# Altium schematic sheet HV_supply.SchDoc: High-voltage power supply
size A4; Author: L. Sartory; Organization: L. Sartory; Address2: Nixie clock; Address3: with GPS synchronization; DocumentNumber: 10; Revision: B1; SheetNumber: 10; SheetTotal: 12
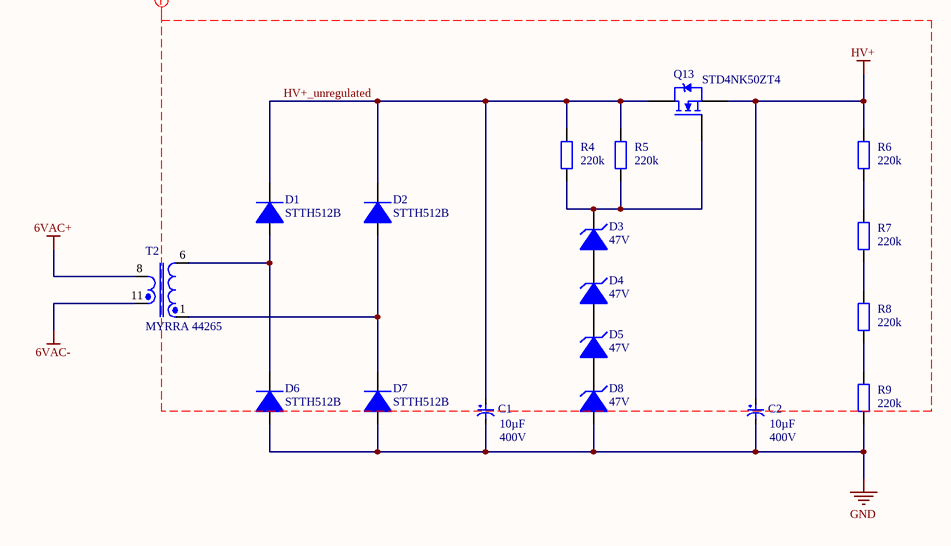
[diagram p0: HV_supply.SchDoc]

## Parts
C1  value 10µF  Voltage: 400V  [EEVEB2G100SM]  (hidden comment: EEVEB2G100SM)
C2  value 10µF  Voltage: 400V  [EEVEB2G100SM]  (hidden comment: EEVEB2G100SM)
D1  STTH512B  [STTH512B]
D2  STTH512B  [STTH512B]
D3  47V  [1SMB5941BT3G]
D4  47V  [1SMB5941BT3G]
D5  47V  [1SMB5941BT3G]
D6  STTH512B  [STTH512B]
D7  STTH512B  [STTH512B]
D8  47V  [1SMB5941BT3G]
Q13  STD4NK50ZT4  [STD4NK50ZT4]
R4  220k  [RES0805]
R5  220k  [RES0805]
R6  220k  [RES0805]
R7  220k  [RES0805]
R8  220k  [RES0805]
R9  220k  [RES0805]
T2  MYRRA 44265  [MYRRA_44265]

## Nets
6VAC+: T2.8
6VAC-: T2.11
GND: C1.2 C2.2 D6.A D7.A D8.A R9.1
HV+: C2.1 Q13.s(S) R6.2
HV+_unregulated: C1.1 D1.K D2.K Q13.D R4.2 R5.2
NetD1_A: D1.A D6.K T2.6
NetD2_A: D2.A D7.K T2.1
NetD3_A: D3.A D4.K
NetD3_K: D3.K Q13.G R4.1 R5.1
NetD4_A: D4.A D5.K
NetD5_A: D5.A D8.K
NetR6_1: R6.1 R7.2
NetR7_1: R7.1 R8.2
NetR8_1: R8.1 R9.2

## Layout directives
net class High_Voltage: HV+, HV+_unregulated

## Notes on the sheet
- Title
- Size:
- Date:
- A4
- Number:
- Time:
- Revision:
- Sheet
- of
- File:
- (in symbol 220k 0805) Text

## Library data of the parts
C1 C2 = EEVEB2G100SM: Aluminum Electrolytic Capacitor, 10µF, 400V; HelpURL: https://datasheet.ciiva.com/17535/aba0000ce11-17535277.pdf
D1 D2 D6 D7 = STTH512B: Ultrafast recovery - 1200 V diode; HelpURL: https://datasheet.ciiva.com/6374/cd00096465-6374991.pdf
D3-D5 D8 = 1SMB5941BT3G: 47V Zener diode; HelpURL: https://datasheet.ciiva.com/15142/getdatasheetpartid-72163-15142395.pdf
Q13 = STD4NK50ZT4: N-CHANNEL 500V - 2.4Ω - 3A DPAK MOSFET; HelpURL: https://datasheet.ciiva.com/4443/cd00003100-79249-4443539.pdf
R4-R9 = 220k 0805: Chip resistor 220k 0805; Value: 220k
T2 = MYRRA 44265: Isolation Transformer 10 VA, 230V, 6V; HelpURL: https://datasheet.ciiva.com/1377/92210-1377460.pdf